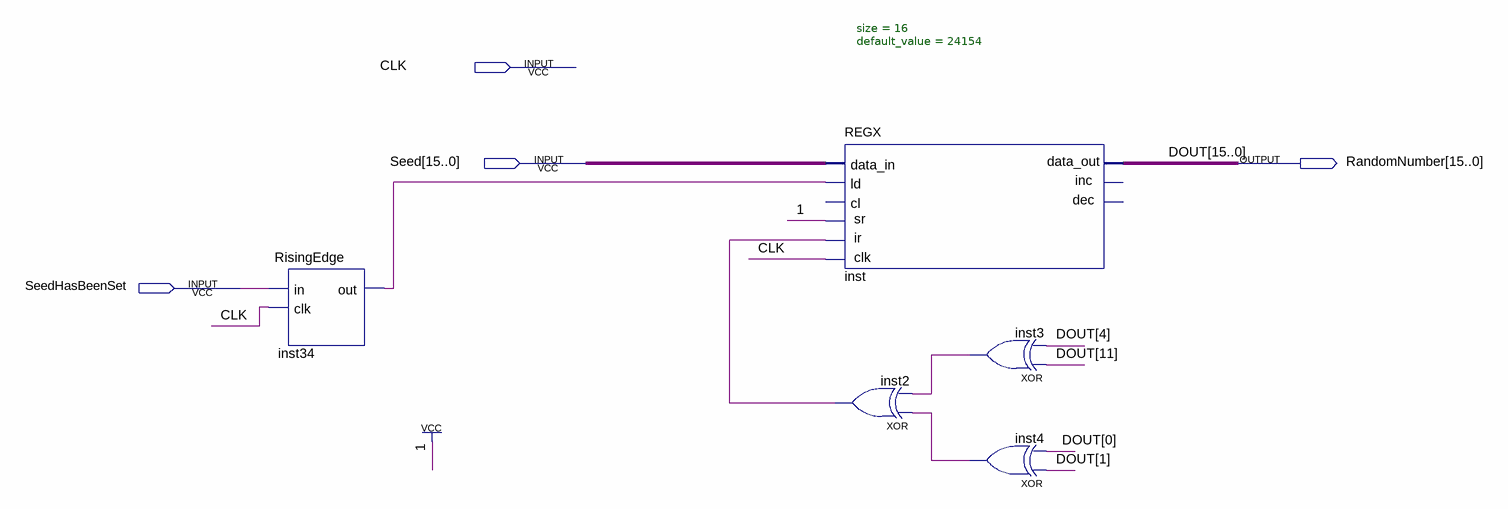
[diagram p0: schematic sheet]
// Quartus schematic RandomGenerator2.bdf as structural Verilog: 5 symbols, 4 pins
module RandomGenerator2 (
  input  CLK,
  input  [15:0] Seed,
  input  SeedHasBeenSet,
  output [15:0] RandomNumber
);

  wire inst2_out, inst3_out, inst4_out, inst34_out;

  RisingEdge inst34 (.in(SeedHasBeenSet), .clk(CLK), .out(inst34_out));
  REGX #(.size(16), .default_value(24154)) inst (
    .clk(CLK), .ld(inst34_out), .sr(1'b1), .ir(inst2_out), .data_in(Seed), .data_out(RandomNumber));  // open: cl, inc, dec
  xor inst2 (inst2_out, inst4_out, inst3_out);
  xor inst3 (inst3_out, RandomNumber[11], RandomNumber[4]);
  xor inst4 (inst4_out, RandomNumber[1], RandomNumber[0]);

  // Other names for the same wires on the sheet: DOUT[15:0] = RandomNumber
endmodule
